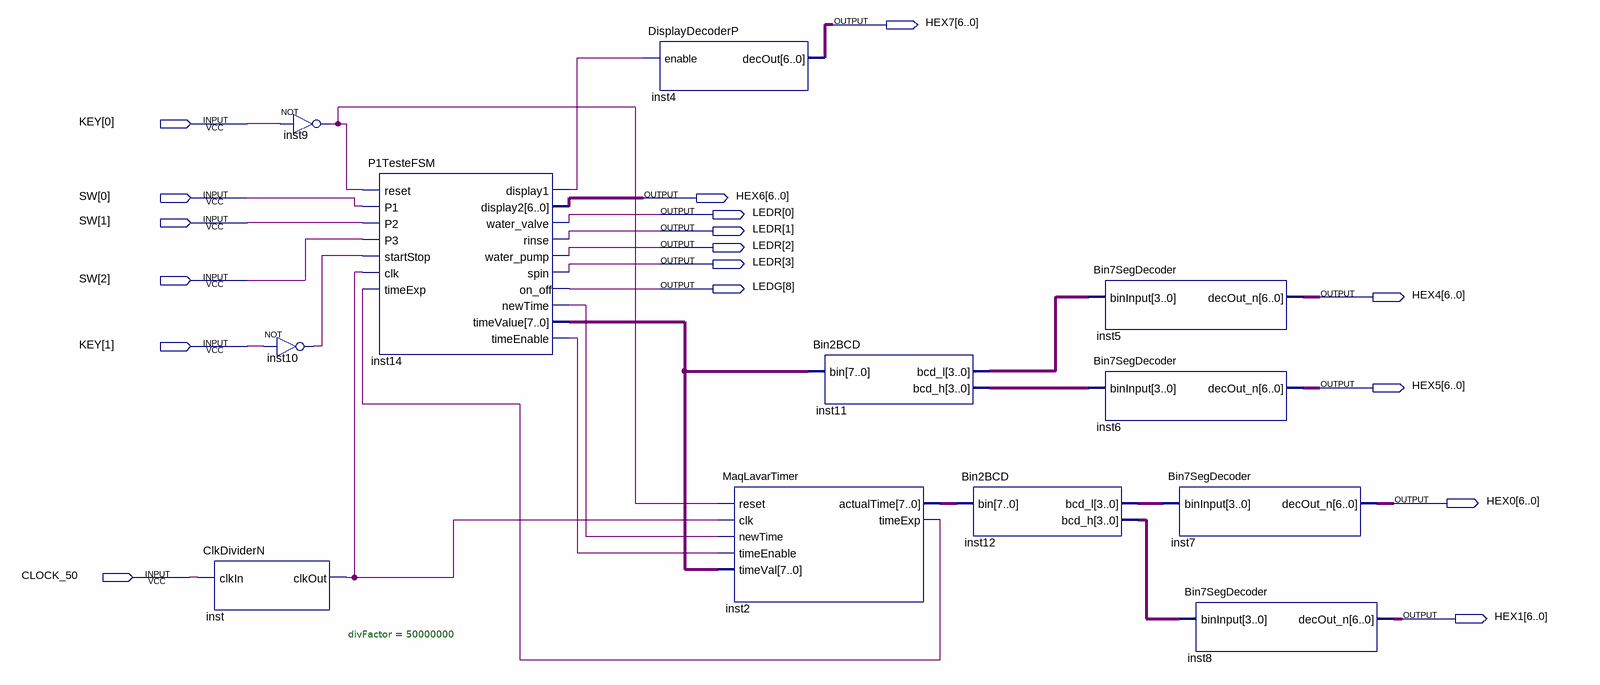
[diagram p0: schematic sheet]
// Quartus schematic P1Teste.bdf as structural Verilog: 12 symbols, 17 pins
module P1Teste (
  input  [1:0] KEY,
  input  [2:0] SW,
  input  CLOCK_50,
  output [6:0] HEX7,
  output [6:0] HEX6,
  output [3:0] LEDR,
  output [8:8] LEDG,
  output [6:0] HEX4,
  output [6:0] HEX5,
  output [6:0] HEX0,
  output [6:0] HEX1
);

  wire inst2_timeexp, inst9_out, inst10_out, inst14_display1, inst14_newtime, inst14_timeenable, inst_clkout;
  wire [3:0] inst11_bcd_h, inst11_bcd_l, inst12_bcd_h, inst12_bcd_l;
  wire [7:0] inst2_actualtime, inst14_timevalue;

  ClkDividerN #(.divFactor(50000000)) inst (.clkIn(CLOCK_50), .clkOut(inst_clkout));
  not inst9 (inst9_out, KEY[0]);
  not inst10 (inst10_out, KEY[1]);
  P1TesteFSM inst14 (
    .reset(inst9_out), .P1(SW[0]), .P2(SW[1]), .P3(SW[2]), .startStop(inst10_out), .clk(inst_clkout),
    .timeExp(inst2_timeexp), .display1(inst14_display1), .display2(HEX6), .water_valve(LEDR[0]),
    .rinse(LEDR[1]), .water_pump(LEDR[2]), .spin(LEDR[3]), .on_off(LEDG[8]), .newTime(inst14_newtime),
    .timeValue(inst14_timevalue), .timeEnable(inst14_timeenable));
  DisplayDecoderP inst4 (.enable(inst14_display1), .decOut(HEX7));
  MaqLavarTimer inst2 (
    .reset(inst9_out), .clk(inst_clkout), .newTime(inst14_newtime), .timeEnable(inst14_timeenable),
    .timeVal(inst14_timevalue), .actualTime(inst2_actualtime), .timeExp(inst2_timeexp));
  Bin2BCD inst11 (.bin(inst14_timevalue), .bcd_l(inst11_bcd_l), .bcd_h(inst11_bcd_h));
  Bin2BCD inst12 (.bin(inst2_actualtime), .bcd_l(inst12_bcd_l), .bcd_h(inst12_bcd_h));
  Bin7SegDecoder inst5 (.binInput(inst11_bcd_l), .decOut_n(HEX4));
  Bin7SegDecoder inst6 (.binInput(inst11_bcd_h), .decOut_n(HEX5));
  Bin7SegDecoder inst7 (.binInput(inst12_bcd_l), .decOut_n(HEX0));
  Bin7SegDecoder inst8 (.binInput(inst12_bcd_h), .decOut_n(HEX1));
endmodule
